# EAGLE design Logic (EAGLE 7.4.0)
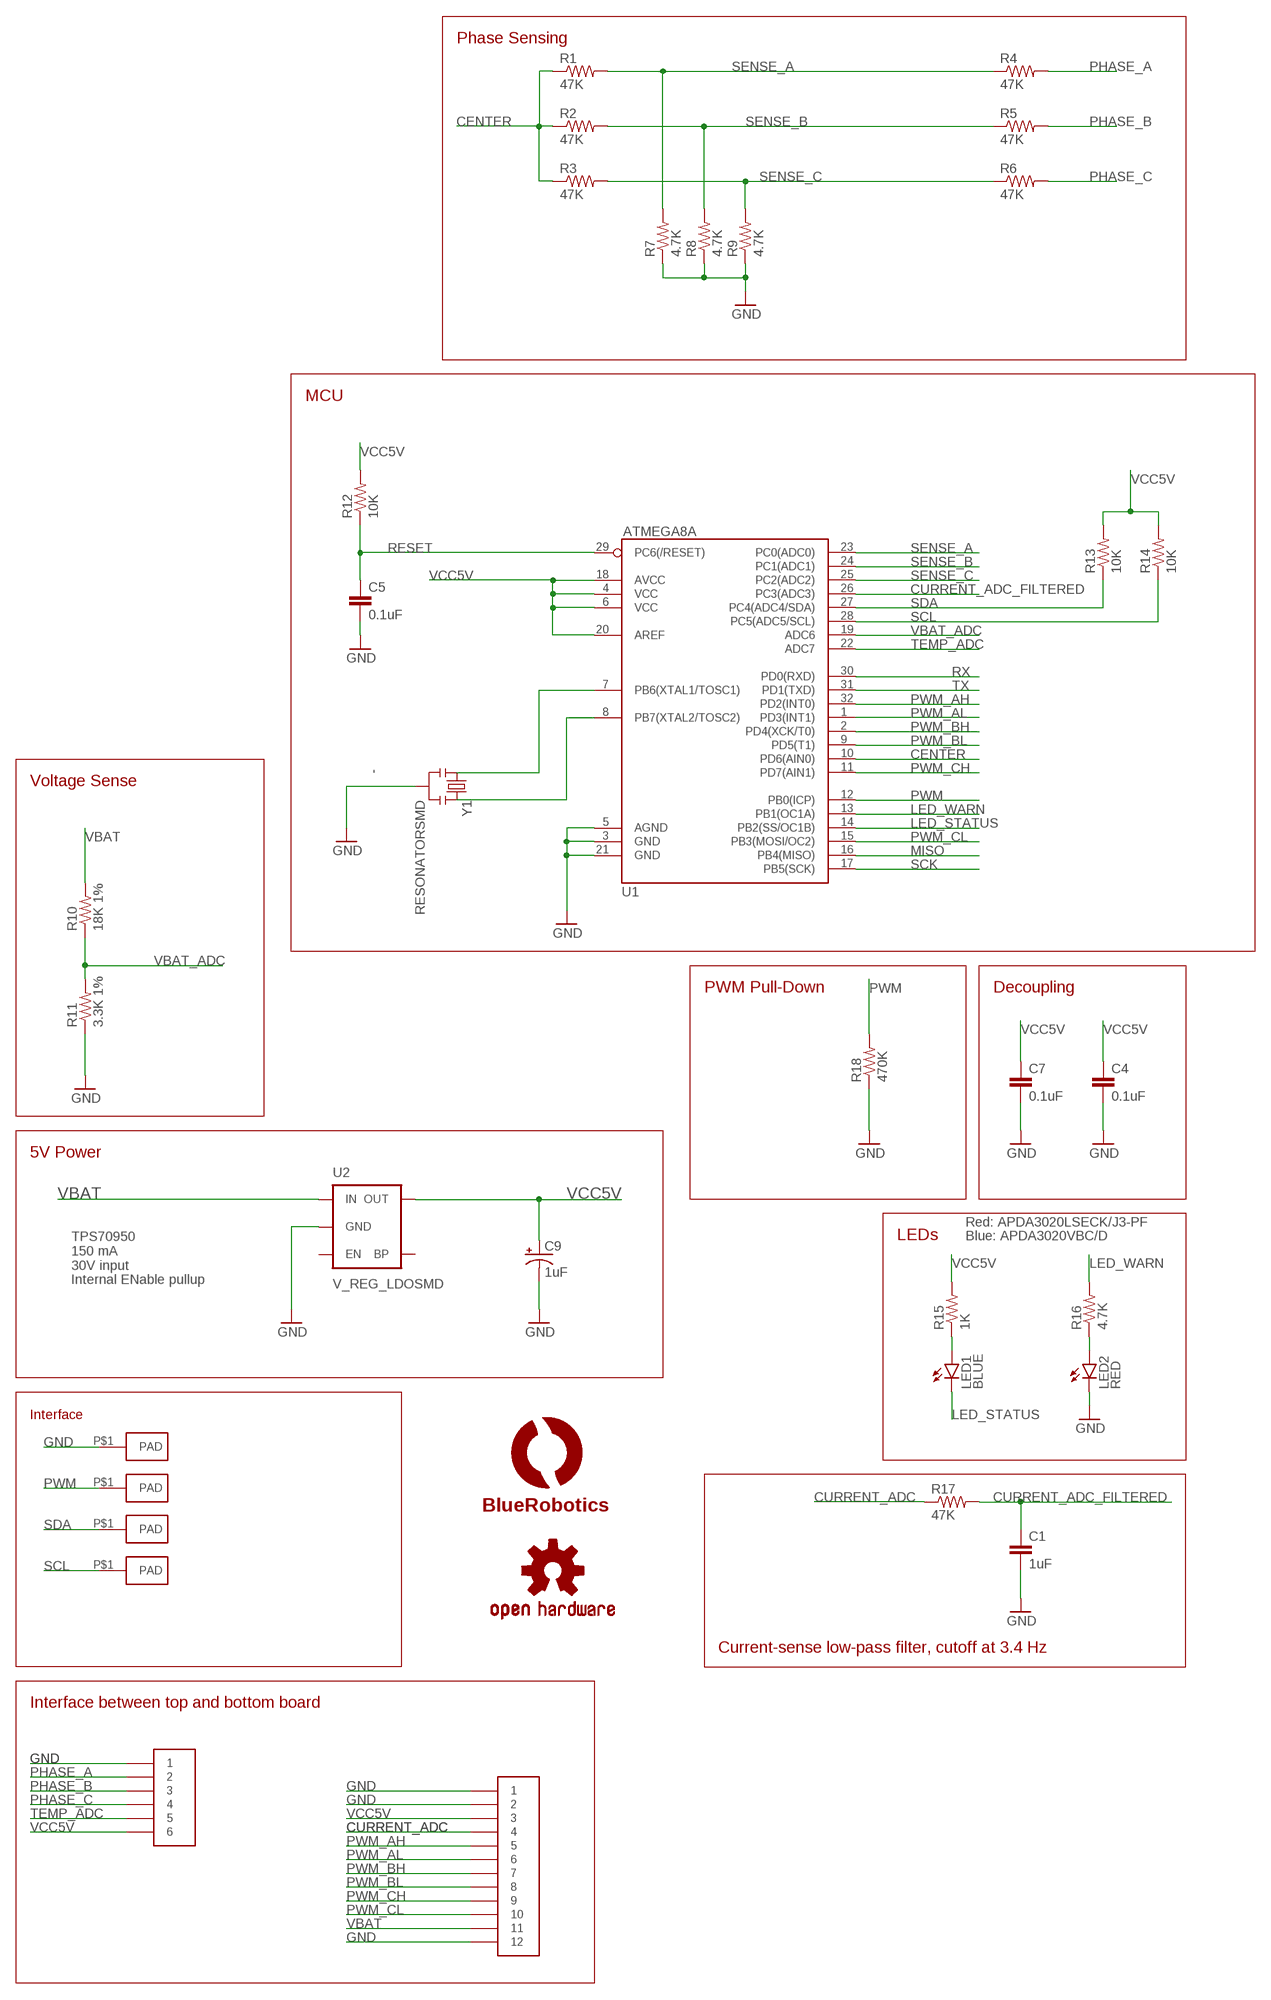
[diagram p0: schematic, sheet 1]

## Parts
C1  1uF  CAP0603-CAP  [0603-CAP]
C4  0.1uF  CAP0603-CAP  [0603-CAP]
C5  0.1uF  CAP0603-CAP  [0603-CAP]
C7  0.1uF  CAP0603-CAP  [0603-CAP]
C9  1uF  CAP_POL1206  [EIA3216]
LED1  BLUE  LED3X2-RA  [SMT-LED-3X2-RA]
LED2  RED  LED3X2-RA  [SMT-LED-3X2-RA]
LOGO1  OSHW-LOGOS  [OSHW-LOGO-S]
R1  47K  33KOHM1/10W1%(0603)  [0603-RES]
R2  47K  33KOHM1/10W1%(0603)  [0603-RES]
R3  47K  33KOHM1/10W1%(0603)  [0603-RES]
R4  47K  33KOHM1/10W1%(0603)  [0603-RES]
R5  47K  33KOHM1/10W1%(0603)  [0603-RES]
R6  47K  33KOHM1/10W1%(0603)  [0603-RES]
R7  4.7K  RESISTOR0603  [0603-RES]
R8  4.7K  RESISTOR0603  [0603-RES]
R9  4.7K  RESISTOR0603  [0603-RES]
R10  18K 1%  33KOHM1/10W1%(0603)  [0603-RES]
R11  3.3K 1%  33KOHM1/10W1%(0603)  [0603-RES]
R12  10K  33KOHM1/10W1%(0603)  [0603-RES]
R13  10K  33KOHM1/10W1%(0603)  [0603-RES]
R14  10K  33KOHM1/10W1%(0603)  [0603-RES]
R15  1K  RESISTOR0603-RES  [0603-RES]
R16  4.7K  RESISTOR0603-RES  [0603-RES]
R17  47K  RESISTOR0603-RES  [0603-RES]
R18  470K  RESISTOR0603-RES  [0603-RES]
U1  ATMEGA168  [TQFP32-08]
U2  V_REG_LDOSMD  [SOT23-5]
U$3  PAD1.5X3MM  [PAD-1.5X3MM]
U$4  LOGOBR-LOGO-M  [BR-LOGO-MEDIUM]
U$9  PAD1.5X3MM  [PAD-1.5X3MM]
U$10  PAD1.5X3MM  [PAD-1.5X3MM]
U$11  PAD1.5X3MM  [PAD-1.5X3MM]
U$16  HEADER-62MM  [HEADER-2MM-6POS]
U$17  HEADER-122MM  [HEADER-2MM-12POS]
Y1  RESONATORSMD  [RESONATOR-SMD]

## Nets
CENTER: R1.1 R2.1 R3.1 U1.10(PD6(AIN0))
CURRENT_ADC: R17.1 U$17.P$4
CURRENT_ADC_FILTERED: C1.1 R17.2 U1.26(PC3(ADC3))
GND: C1.2 C4.2 C5.2 C7.2 C9.C(-) LED2.2(C) R7.1 R8.1 R9.1 R11.1 R18.1 U1.3(GND) U1.5(AGND) U1.21(GND) U2.2(GND) U$3.P$1(PAD) U$16.P$1 U$17.P$1 U$17.P$2 U$17.P$12 Y1.2
LED_STATUS: LED1.2(C) U1.14(PB2(SS/OC1B))
LED_WARN: R16.2 U1.13(PB1(OC1A))
MISO: U1.16(PB4(MISO))
N$3: LED2.1(A) R16.1
N$10: U1.7(PB6(XTAL1/TOSC1)) Y1.1
N$11: U1.8(PB7(XTAL2/TOSC2)) Y1.3
N$16: LED1.1(A) R15.1
PHASE_A: R4.2 U$16.P$2
PHASE_B: R5.2 U$16.P$3
PHASE_C: R6.2 U$16.P$4
PWM: R18.2 U1.12(PB0(ICP)) U$11.P$1(PAD)
PWM_AH: U1.32(PD2(INT0)) U$17.P$5
PWM_AL: U1.1(PD3(INT1)) U$17.P$6
PWM_BH: U1.2(PD4(XCK/T0)) U$17.P$7
PWM_BL: U1.9(PD5(T1)) U$17.P$8
PWM_CH: U1.11(PD7(AIN1)) U$17.P$9
PWM_CL: U1.15(PB3(MOSI/OC2)) U$17.P$10
RESET: C5.1 R12.1 U1.29(PC6(/RESET))
RX: U1.30(PD0(RXD))
SCK: U1.17(PB5(SCK))
SCL: R14.1 U1.28(PC5(ADC5/SCL)) U$10.P$1(PAD)
SDA: R13.1 U1.27(PC4(ADC4/SDA)) U$9.P$1(PAD)
SENSE_A: R1.2 R4.1 R7.2 U1.23(PC0(ADC0))
SENSE_B: R2.2 R5.1 R8.2 U1.24(PC1(ADC1))
SENSE_C: R3.2 R6.1 R9.2 U1.25(PC2(ADC2))
TEMP_ADC: U1.22(ADC7) U$16.P$5
TX: U1.31(PD1(TXD))
VBAT: R10.2 U2.1(IN) U$17.P$11
VBAT_ADC: R10.1 R11.2 U1.19(ADC6)
VCC5V: C4.1 C7.1 C9.A(+) R12.2 R13.2 R14.2 R15.2 U1.4(VCC) U1.6(VCC) U1.18(AVCC) U1.20(AREF) U2.5(OUT) U$16.P$6 U$17.P$3
Unconnected: U2.3(EN) U2.4(BP)

## Notes on the sheet
- Phase Sensing
- MCU
- ATMEGA8A
- Voltage Sense
- PWM Pull-Down | Decoupling
- 5V Power
- Red: APDA3020LSECK/J3-PF
- LEDs | Blue: APDA3020VBC/D
- TPS70950
  150 mA
  30V input
  Internal ENable pullup
- Interface
- Current-sense low-pass filter, cutoff at 3.4 Hz
- Interface between top and bottom board

## Library data of the parts
C1 C4 C5 C7 = SparkFun-Capacitors:CAP: Capacitor Standard 0603 ceramic capacitor, and 0.1" leaded capacitor.
C9 = SparkFun-Capacitors:CAP_POL: Capacitor Polarized These are standard SMD and PTH capacitors. Normally 10uF, 47uF, and 100uF in electrolytic and tantalum varieties. Always verify the external diameter of the through hole cap, it varies with capacity, voltage, and manufacturer. The EIA devices should be standard.
LED1 LED2 = BR-Eagle-Library:LED: LEDs Standard schematic elements and footprints for 5mm, 3mm, 1206, and 0603 sized LEDs. 5mm - Spark Fun Electronics SKU : COM-00529 (and others)
LOGO1 = SparkFun-Aesthetics:OSHW-LOGO: Open Source Hardware Logo This logo indicates the piece of hardware it is found on incorporates a OSHW license and/or adheres to the definition of open source hardware found here: http://freedomdefined.org/OSHW
R1-R6 R10-R14 = SparkFun-Resistors:33KOHM1/10W1%(0603): RES-08416
R7-R9 = SparkFun-Resistors:RESISTOR: Resistor Basic schematic elements and footprints for 0603, 1206, and PTH resistors.
R15-R18 = SparkFun:RESISTOR: Resistor Basic schematic elements and footprints for 0603, 1206, and PTH resistors.
U1 = SparkFun-DigitalIC:ATMEGA168: Atmel 32-pin 8-bit micro, 16k flash.
U2 = SparkFun-PowerIC:V_REG_LDO: Voltage Regulator LDO Standard 150mA LDO voltage regulator in SOT-23 layout. Micrel part MIC5205. BP (by-pass) pin is used to lower output noise with 470pF cap.
U$3 U$9-U$11 = BR-Eagle-Library:PAD
U$4 = BR-Eagle-Library:LOGO
U$16 = BR-Eagle-Library:HEADER-6
U$17 = BR-Eagle-Library:HEADER-12
Y1 = SparkFun:RESONATOR: Resonator Small SMD resonator. This is the itty bitty 10/20MHz resonators with built in caps. CSTCE10M0G55 and CSTCE20M0V53. Footprint has been reviewed closely but hasn't been tested yet.

## Board
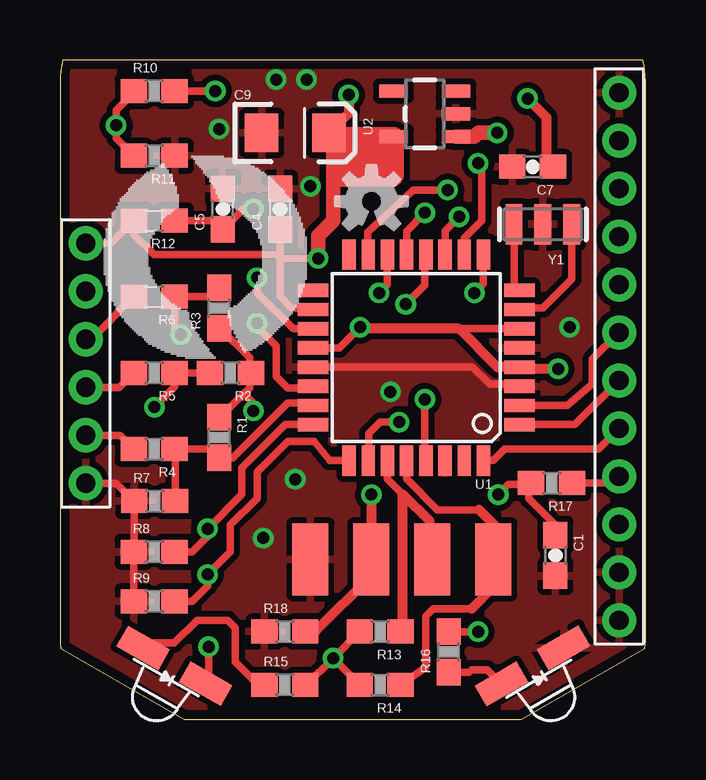
[diagram p1: board, top side]
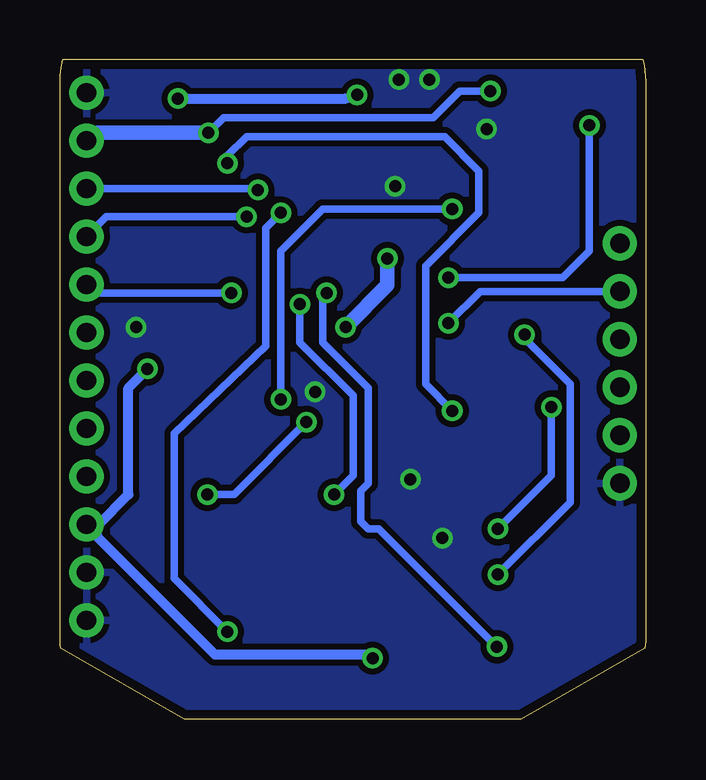
[diagram p2: board, bottom side, seen from below]

Size 24.4 x 27.5 mm. Coordinates in mm from the lower left corner, seen from the top.
Outline: 24.28,27.5 0.12,27.5 arc15 0,26.6 0,3.4 arc7 0.03,2.98 5.18,0 19.22,0 24.37,2.98 arc7 24.4,3.4 24.4,26.6 arc15 24.28,27.5
Outline: 24.28,27.5 24.28,27.5
Copper layers (1*16): Top 0.0356mm / dielectric 1.5011mm / Bottom 0.0356mm
Design rules "OSH-Park": minimum track width 6mil, minimum drill 13mil, track to track 6mil, track to pad 6mil, pad to pad 6mil, via to via 6mil, smd to smd 6mil, copper to edge 15mil, drill to drill 6mil, minimum pad ring 7mil, minimum via ring 7mil, stop-mask expansion 3mil, vias tented up to drill 0mil, thermal gap 10mil

### Footprints (pad centres in the part's own frame; a part is rotated, then mirrored left to right if it is on the bottom)
0603-CAP = smd 1.1 x 1: 1 -0.85,0; 2 0.85,0
EIA3216 = smd 1.4 x 1.6: A 1.4,0; C -1.4,0
SMT-LED-3X2-RA = smd 2 x 1: 1 1.5,0; 2 -1.5,0
0603-RES = smd 1.1 x 1: 1 -0.85,0; 2 0.85,0
TQFP32-08 = smd 1.27 x 0.559: 1 -4.293,2.8; 2 -4.293,2; 3 -4.293,1.2; 4 -4.293,0.4; 5 -4.293,-0.4; 6 -4.293,-1.2; 7 -4.293,-2; 8 -4.293,-2.8; 17 4.293,-2.8; 18 4.293,-2; 19 4.293,-1.2; 20 4.293,-0.4; 21 4.293,0.4; 22 4.293,1.2; 23 4.293,2; 24 4.293,2.8 | smd 0.559 x 1.27: 9 -2.8,-4.293; 10 -2,-4.293; 11 -1.2,-4.293; 12 -0.4,-4.293; 13 0.4,-4.293; 14 1.2,-4.293; 15 2,-4.293; 16 2.8,-4.293; 25 2.8,4.293; 26 2,4.293; 27 1.2,4.293; 28 0.4,4.293; 29 -0.4,4.293; 30 -1.2,4.293; 31 -2,4.293; 32 -2.8,4.293
SOT23-5 = smd 0.55 x 1.2: 1 -0.95,-1.3; 2 0,-1.3; 3 0.95,-1.3; 4 0.95,1.3; 5 -0.95,1.3
PAD-1.5X3MM = smd 3 x 1.5: P$1 0,0
HEADER-2MM-6POS = drill 0.8 pad 1.422: P$1 0,0; P$2 2,0; P$3 4,0; P$4 6,0; P$5 8,0; P$6 10,0
HEADER-2MM-12POS = drill 0.8 pad 1.422: P$1 0,0; P$2 2,0; P$3 4,0; P$4 6,0; P$5 8,0; P$6 10,0; P$7 12,0; P$8 14,0; P$9 16,0; P$10 18,0; P$11 20,0; P$12 22,0
RESONATOR-SMD = smd 0.7 x 1.7: 1 -1.2,0; 2 0,0; 3 1.2,0

### Placement (x,y rotation side)
C1  20.64,6.84 270 top
C4  9.17,21.28 90 top
C5  6.79,21.28 90 top
C7  19.69,23.05 180 top
C9  9.8,24.46 0 top
LED1  4.77,2.24 150.3 top
LED2  19.69,2.24 210.2 top
LOGO1  12.98,21.6 0 top
R1  6.63,11.76 270 top
R2  7.1,14.46 180 top
R3  6.63,17.16 90 top
R4  3.93,11.28 180 top
R5  3.93,14.46 180 top
R6  3.93,17.63 180 top
R7  3.94,9.11 0 top
R8  3.93,7 0 top
R9  3.93,4.93 0 top
R10  3.93,26.2 0 top
R11  3.93,23.51 180 top
R12  3.93,20.81 180 top
R13  13.34,3.67 180 top
R14  13.34,1.45 180 top
R15  9.37,1.45 0 top
R16  16.2,2.82 90 top
R17  20.48,9.86 180 top
R18  9.37,3.67 0 top
U1  14.84,15.09 180 top
U2  15.2,25.25 90 top
U$3  10.44,6.68 90 top
U$4  1.86,15.09 0 top
U$9  15.52,6.68 90 top
U$10  18.06,6.68 90 top
U$11  12.98,6.68 90 top
U$16  1.07,9.85 90 top
U$17  23.3,4.14 90 top
Y1  20.12,20.65 180 top

### Tracks (layer width: path | path; a pad name or v marks a point on that pad's centre or on a via)
CENTER  (via drill 0.5)
  Top 0.305: R1.1 6.68,12.61 7.66,13.58 | 7.66,13.58 7.9,13.82 7.9,14.4 R2.1 7.9,14.51 7.9,15.09 6.68,16.31 R3.1 | U1.10 16.84,20.07 17.58,20.81 17.58,23.03 v17.42,23.19 | v8.06,12.87 8.06,13.19 7.66,13.58
  Bottom 0.305: v17.42,23.19 17.42,23.51 16.63,24.3 8.37,24.3 6.94,22.87 6.94,21.13 9.17,18.9 9.17,13.98 v8.06,12.87
CURRENT_ADC
  Top 0.305: R17.1 23.02,9.86 U$17.P$4
CURRENT_ADC_FILTERED  (via drill 0.5)
  Top 0.305: C1.1 20.64,8.11 19.53,9.23 19.53,9.8 | 19.53,9.8 R17.2 | 19.53,9.8 18.68,9.8 v18.26,9.38 | U1.26 12.86,10.82 12.86,11.92 13.34,12.4 v14.13,12.4
  Bottom 0.305: v18.26,9.38 17.15,9.38 v14.13,12.4
GND  (via drill 0.5)
  Top 0.305: U$16.P$1 2.34,9.85 R7.1 3.09,7.01 R8.1 R9.1 | U1.21 17.19,14.69 17.9,13.98 19.05,13.98 U1.3
  other vias: 21.23,16.36 6.63,24.62 8.47,7.57 10.44,22.24 9.01,26.68 10.28,26.68 9.8,10.01 13.77,13.66
  pour Top (isolate 0.254): -0.9,-3.74 26.1,-3.74 26.1,34.26 -0.9,34.26
  pour Bottom (isolate 0.254): -3.9,-2.74 25.1,-2.74 25.1,34.26 -3.9,34.26
LED_STATUS  (via drill 0.5)
  Top 0.305: U1.14 13.64,18.14 v13.29,17.79 | v6.19,3.03 6.19,1.62 LED1.2
  Bottom 0.305: v13.29,17.79 13.45,17.63 13.45,15.73 11.55,13.82 11.55,9.85 11.87,9.54 11.87,8.27 11.55,7.95 11.11,7.95 v6.19,3.03
LED_WARN  (via drill 0.5)
  Top 0.305: U1.13 14.44,20.37 v15.2,21.13 | v17.42,3.66 16.05,3.66 R16.2
  Bottom 0.305: v17.42,3.66 19.64,5.89 19.64,11.92 15.83,15.57 15.83,20.49 v15.2,21.13
MISO
  Top 0.305: 12.02,19.4 U1.16
N$3
  Top 0.305: R16.1 17.04,1.97 17.15,2.08 17.8,2.08 LED2.1
N$10
  Top 0.305: Y1.1 21.32,18.36 20.12,17.16 19.2,17.16 U1.7
N$11
  Top 0.305: Y1.3 18.92,18.11 U1.8
N$16
  Top 0.305: R15.1 8.26,1.45 7.31,2.4 7.31,3.83 6.99,4.15 5.72,4.15 4.77,3.19 3.67,3.19 LED1.1
PHASE_A
  Top 0.305: U$16.P$2 2.51,11.85 R4.2
PHASE_B
  Top 0.305: U$16.P$3 2.47,13.85 R5.2
PHASE_C
  Top 0.305: U$16.P$4 1.3,15.85 R6.2
PWM  (via drill 0.5)
  Top 0.305: v14.41,17.32 15.2,18.11 15.2,19.34 U1.12 | R18.2 10.64,3.67 | 13.02,6.05 13.02,6.63 U$11.P$1
  Top 0.406: v12.98,9.38 U$11.P$1 | 10.64,3.67 13.02,6.05
  Bottom 0.305: v12.98,9.38 12.18,10.17 12.18,13.51 14.41,15.73 v14.41,17.32
PWM_AH
  Top 0.305: U1.32 18.05,10.8 18.53,11.28 22.44,11.28 U$17.P$5
PWM_AL
  Top 0.305: U1.1 21.45,12.29 U$17.P$6
PWM_BH
  Top 0.305: U1.2 21.14,13.09 22.18,13.98 22.18,15.03 U$17.P$7
PWM_BL  (via drill 0.5)
  Top 0.305: U1.9 17.64,18.17 v17.26,17.79
  Bottom 0.305: v17.26,17.79 22.95,17.79 U$17.P$8
PWM_CH  (via drill 0.5)
  Top 0.305: U1.11 16.04,20.38 v16.63,20.97
  Bottom 0.305: v16.63,20.97 22.47,20.97 U$17.P$9
PWM_CL  (via drill 0.5)
  Top 0.305: v16.15,22.08 14.72,22.08 12.82,20.33 12.82,19.41 U1.15
  Bottom 0.305: U$17.P$10 16.21,22.14 v16.15,22.08
RESET  (via drill 0.5)
  Top 0.305: R12.1 6.41,20.81 C5.1 7.64,21.28 v8.06,21.28 | v15.2,13.35 15.04,13.19 15.2,13.03 15.2,10.84 U1.29
  Bottom 0.305: v8.06,21.28 13.45,21.28 15.2,19.54 v15.2,13.35
RX
  Top 0.305: U1.30 16.04,10.28
SCL
  Top 0.305: U1.28 14.44,10.03 15.72,8.75 17.47,8.75 | 18.1,8.11 18.1,6.72 U$10.P$1 18.1,6.63 18.1,5.57 | 17.15,4.62 15.56,4.62 15.24,4.3 15.24,2.18 R14.1
  Top 0.406: 17.47,8.75 18.1,8.11 | 17.15,4.62 18.1,5.57
SDA
  Top 0.305: U1.27 13.64,10.03 14.29,9.38 | 15.4,8.27 15.4,6.79 U$9.P$1 15.08,6.25 15.08,5.73 | 14.29,3.77 R13.1
  Top 0.406: 15.4,8.27 14.29,9.38 14.29,3.77
SENSE_A
  Top 0.305: R7.2 4.79,11.27 R4.1 6.25,11.28 R1.2 7.21,10.91 9.48,13.19 10.46,13.19 U1.23
SENSE_B  (via drill 0.5)
  Top 0.305: v3.93,13.03 4.78,13.88 R5.1 R2.2 | R8.2 5.52,7 6.15,7.63 v6.15,7.95 7.58,9.38 7.58,10.49 9.38,12.29 U1.24
  Bottom 0.305: v3.93,13.03 3.93,10.17 v6.15,7.95
SENSE_C  (via drill 0.5)
  Top 0.305: R9.2 5.52,4.93 6.15,5.57 v6.15,6.04 7.1,7 7.1,8.11 8.21,9.22 8.21,10.33 9.48,11.6 10.6,11.6 11.24,10.8 U1.25 | R3.2 6.25,17.63 R6.1 4.78,16.31 v5.04,16.05
  Bottom 0.305: v5.04,16.05 5.04,15.89 3.13,13.98 3.13,9.06 v6.15,6.04
TEMP_ADC  (via drill 0.5)
  Top 0.305: v8.21,16.52 8.21,16.36 9.01,15.57 9.01,14.3 9.48,13.82 10.48,13.82 U1.22
  Bottom 0.305: U$16.P$5 6.88,17.85 v8.21,16.52
VBAT  (via drill 0.5)
  Top 0.305: R10.2 v6.47,26.21
  Top 0.61: v18.22,24.46 17.42,24.46 17.26,24.3 U2.1
  Bottom 0.305: v6.47,26.21 7.74,26.21 8.85,25.09 17.58,25.09 v18.22,24.46
  Bottom 0.61: U$17.P$11 23.14,24.14 22.82,24.46 v18.22,24.46
VBAT_ADC  (via drill 0.5)
  Top 0.305: U1.19 9.71,16.29 8.21,17.79 v8.21,18.43 | R11.2 2.34,24.24 v2.34,24.78 2.34,25.41 3.08,26.15 R10.1
  Bottom 0.305: v8.21,18.43 3.45,18.43 2.34,19.54 v2.34,24.78
VCC5V  (via drill 0.5)
  Top 0.305: U$16.P$6 2.12,19.85 R12.2 3.08,20.23 3.93,19.38 9.01,19.38 9.17,19.22 | 10.47,15.41 U1.20 11.63,15.49 v12.5,16.36 12.57,16.29 | C4.1 9.17,19.22 | 9.17,19.22 9.17,17.63 9.64,17.16 10.49,17.16 U1.18 | v10.75,19.22 9.17,19.22 | 20.28,23.31 C7.1 | U1.6 16.63,16.29 | v11.38,2.56 R14.2 | v11.38,2.56 R13.2 | R15.2 10.27,1.45 v11.38,2.56 | U2.5 13.9,24.09 13.81,24
  Top 0.406: 12.57,16.29 16.63,16.29 18.23,14.69 U1.4 19.22,14.62 v20.76,14.62 | 20.28,23.31 20.28,25.09 v19.49,25.89 | v12.02,26.05 12.02,25.28 C9.A 11.36,24.3
  Top 0.61: v10.75,19.22 10.75,20.17 11.39,20.81 11.39,24.27 C9.A
  Top 0.813: U2.5 11.36,24.3
  Top 1.016: 11.75,23.51 13.66,23.51 13.66,24.15 13.81,24.15 13.81,24 13.81,22.72 11.59,22.72
  Bottom 0.406: v20.76,14.62 21.55,13.82 21.55,9.38 22.79,8.14 U$17.P$3 22.86,7.71 22.86,7.64 17.94,2.72 11.54,2.72 v11.38,2.56 | v19.49,25.89 12.5,25.89 v12.02,26.05
  Bottom 0.61: v10.75,19.22 10.75,18.11 v12.5,16.36

### Text on the board
tDocu: rev7 | BLK | R/Y | WHT | GRN | GND | PWM | SDA | SCL | BlueESC | B | R
bDocu: BLUEESC-ELEC-LOGIC-R1.1 | 9/15 | Designed by R. Jehangir | BlueRobotics